# EasyEDA Pro project hub_2025-11-01.epro

# Schematic hub
Board Name: hub; Create Date: 2025-10-30; Page Name: Sheet_1; Project Name: Makro; Schematic Name: hub; Update Date: 2025-10-30; Add into BOM: yes; Convert to PCB: yes; Sheet: 1/1; spicePre: .
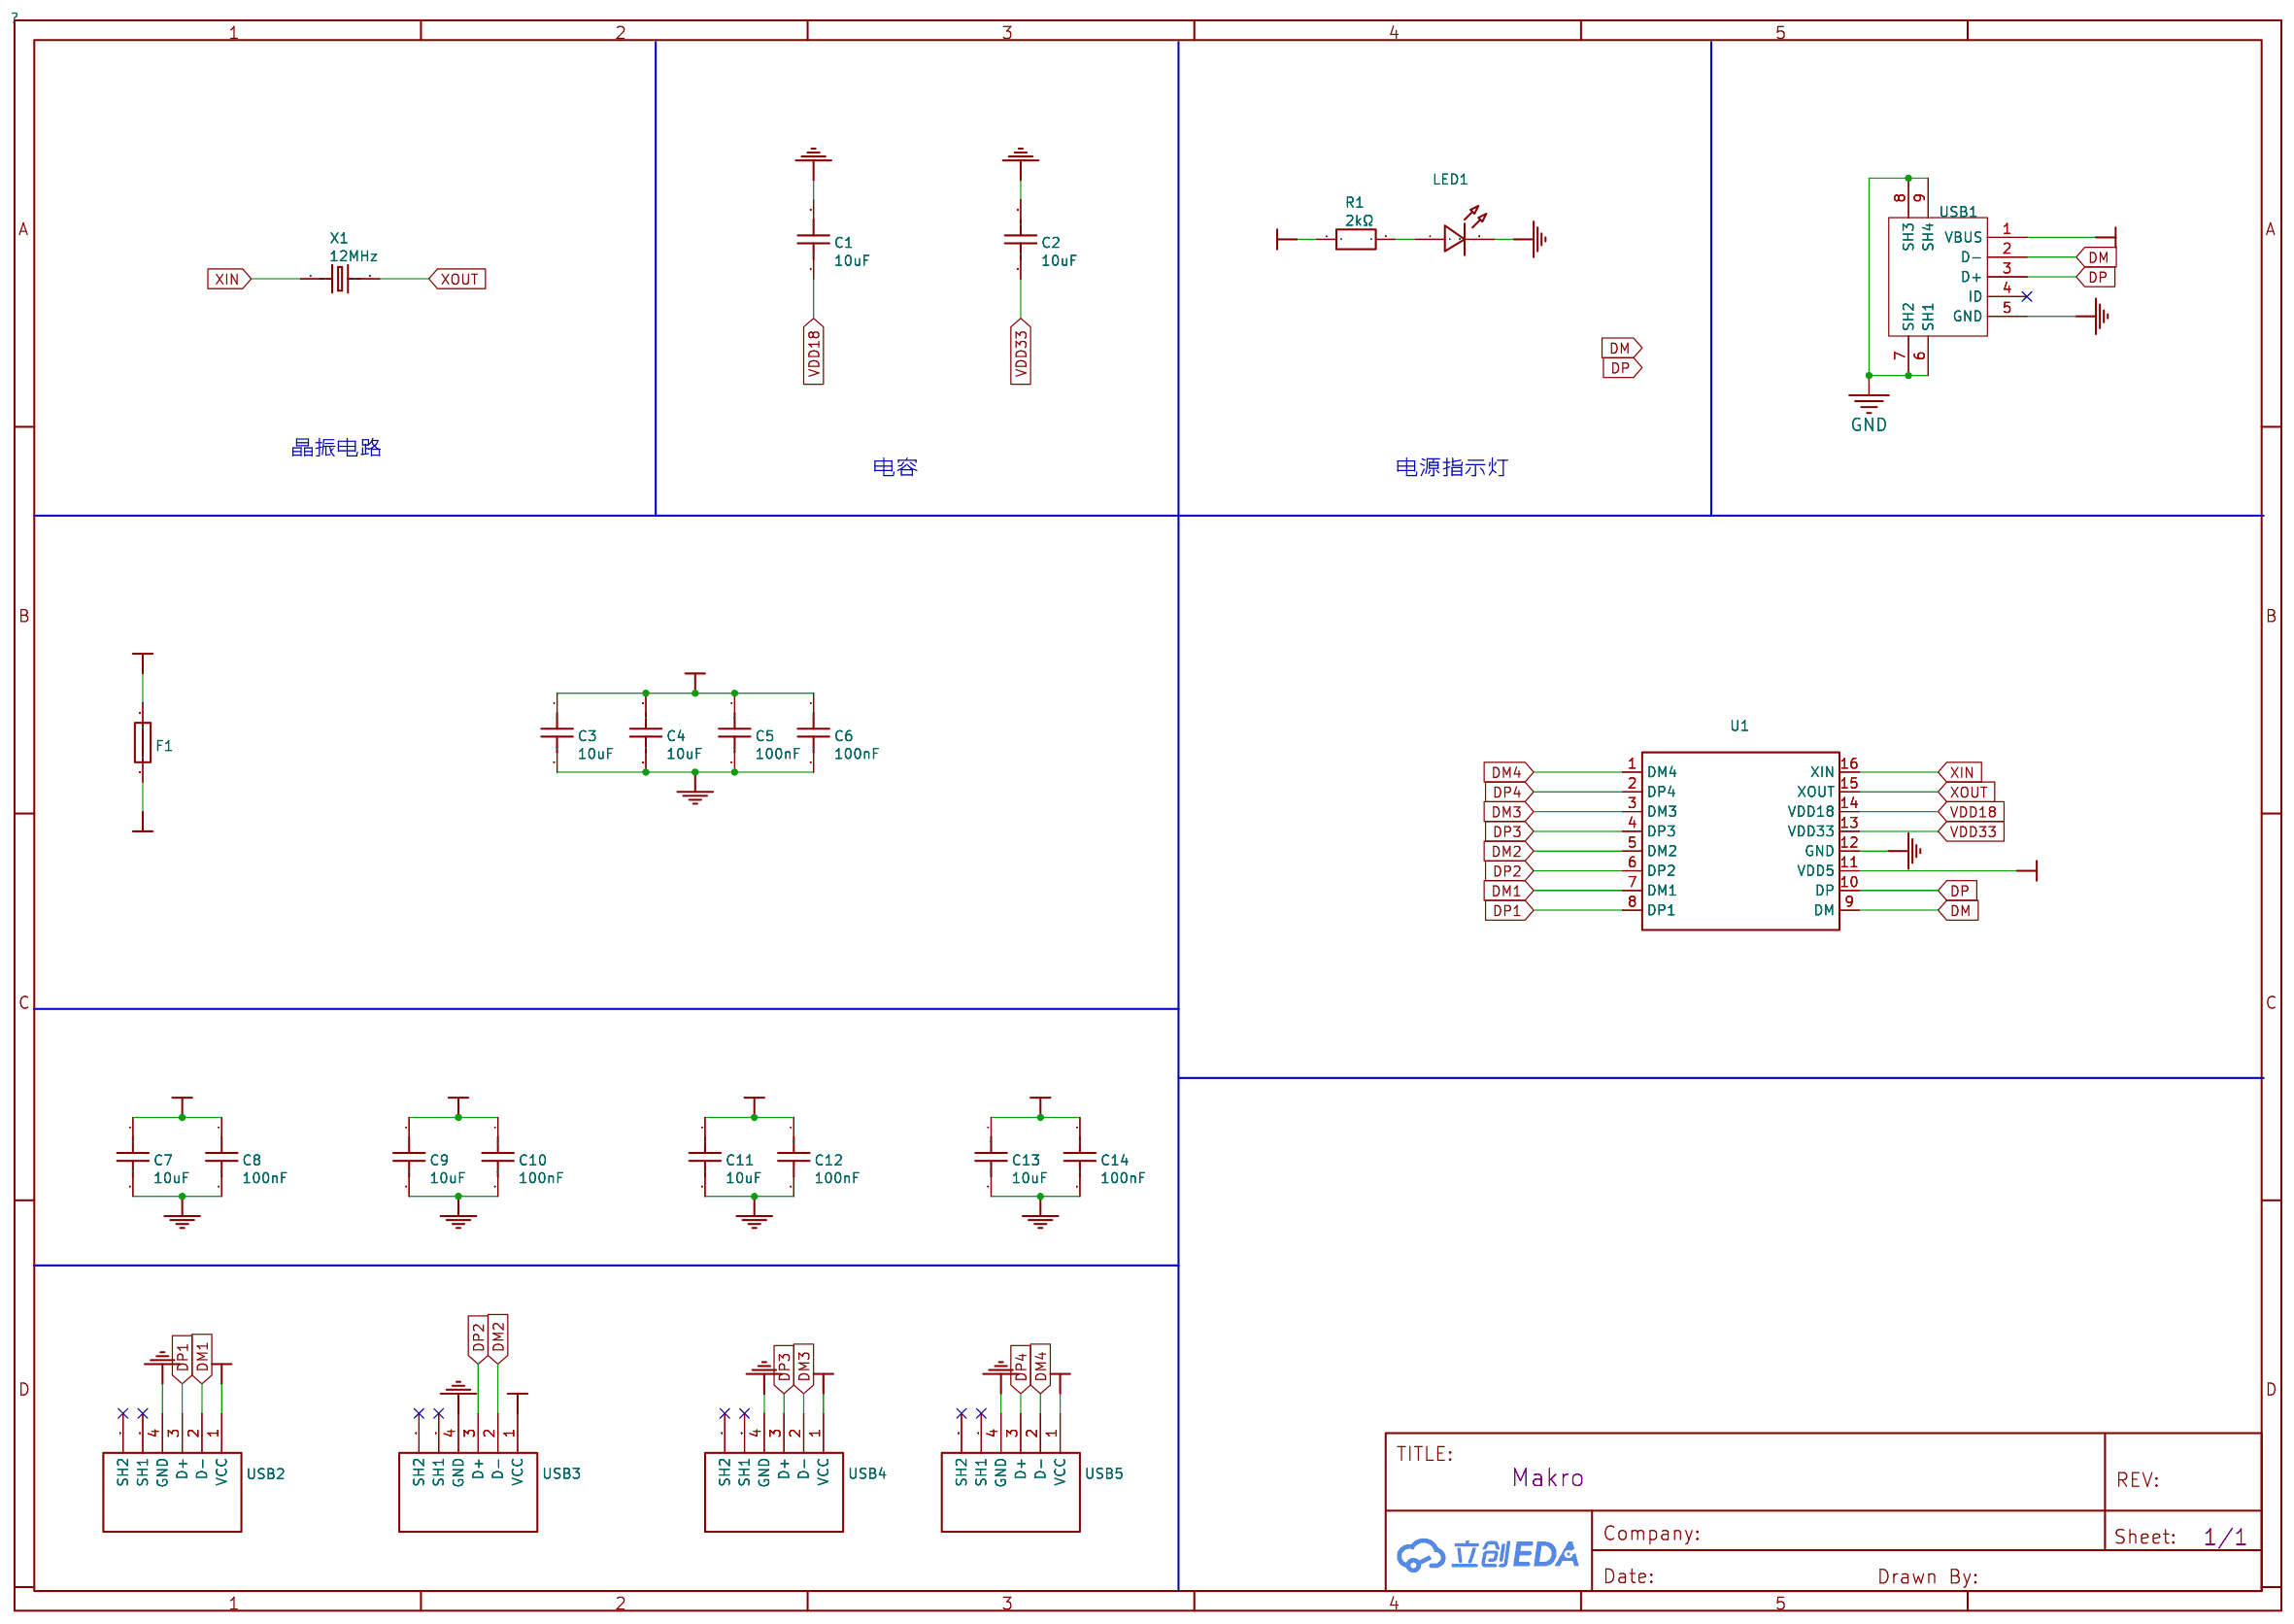
[diagram p0: schematic sheet]

## Parts
C1  10uF  [C0603]
C2  10uF  [C0603]
C3  10uF  [C0603]
C4  10uF  [C0603]
C5  100nF  [C0603]
C6  100nF  [C0603]
C7  10uF  [C0603]
C8  100nF  [C0603]
C9  10uF  [C0603]
C10  100nF  [C0603]
C11  10uF  [C0603]
C12  100nF  [C0603]
C13  10uF  [C0603]
C14  100nF  [C0603]
F1  FSMD100-1206R  [F1206]
LED1  19-217/R6C-AL1M2VY/3T  [LED0603-RD]
R1  2kΩ  [R0603]
U1  SL2.1A  [SOP-16_L10.0-W3.9-P1.27-LS6.0-BL]
USB1  MicroXNJ  [MICRO-USB-SMD_MICROXNJ]
USB2  U-USBAR04P-F002  [USB-A-TH_USB-302-T]
USB3  U-USBAR04P-F002  [USB-A-TH_USB-302-T]
USB4  U-USBAR04P-F002  [USB-A-TH_USB-302-T]
USB5  U-USBAR04P-F002  [USB-A-TH_USB-302-T]
X1  12MHz  [HC-49US_L11.5-W4.5-P4.88]

## Library data of the parts
C1-C4 C7 C9 C11 C13 = 0603X106M6R3NT: Capacitance:10uF Tolerance:±20% Tolerance:±20% Voltage Rating:6.3V Temperature Coefficient:X5R; LCSC Part Name: 10uF ±20% 6.3V; Supplier Part: C105490; Manufacturer: FH(风华); Supplier Footprint: 0603; JLCPCB Part Class: Extended Part; Datasheet: https://item.szlcsc.com/datasheet/0603X106M6R3NT/106705.html; Supplier: LCSC; Tolerance: ±20%; Voltage Rating: 6.3V; Temperature Coefficient: X5R
C5 C6 C8 C10 C12 C14 = C0603X104K101T: Capacitance:100nF Tolerance:±10% Tolerance:±10% Voltage Rating:100V Temperature Coefficient:X7R; LCSC Part Name: 100nF ±10% 100V; Supplier Part: C105907; Manufacturer: IHHEC(禾伸堂); Supplier Footprint: 0603; JLCPCB Part Class: Extended Part; Datasheet: https://item.szlcsc.com/datasheet/C0603X104K101T/107122.html; Supplier: LCSC; Tolerance: ±10%; Voltage Rating: 100V; Temperature Coefficient: X7R
F1 = FSMD100-1206R: Voltage - Max:6V Current - Max:100A Hold Current:1A Trip Current:1.8A Power Dissipation:600mW Resistance - Initial (Ri) (Min):55mΩ Resistance - Post Trip (R1) (Max):210mΩ Time to Trip(Max):300ms Operating Temperature:-40℃~+85℃ Operating Temperature:-40℃~+; LCSC Part Name: 1A  6V自恢复保险丝; Supplier Part: C220149; Manufacturer: FUZETEC(富致); Supplier Footprint: 1206; JLCPCB Part Class: Extended Part; Datasheet: https://item.szlcsc.com/datasheet/FSMD100-1206R/220722.html; Supplier: LCSC; Voltage - Max: 6V; Current - Max: 100A; Hold Current: 1A; Trip Current: 1.8A; Power Dissipation: 600mW; Resistance - Initial (Ri) (Min): 55mΩ; Resistance - Post Trip (R1) (Max): 210mΩ; Time to Trip(Max): 300ms; Operating Temperature: -40℃~+85℃; Length: 3.5mm; Width: 1.8mm; Height: 1mm
LED1 = 19-217/R6C-AL1M2VY/3T: Illumination Color:Red Voltage - Forward(Vf):1.95V Voltage - Forward(Vf):1.95V Power(Watts):60mW Forward Current:5mA Wavelength - Dominant:617.5nm Wavelength - Dominant:617.5nm Peak Wavelength:632nm Diode Configuration:- Lens Color:Water Clear Color Tempe; LCSC Part Name: 红灯 停产; Supplier Part: C72044; Manufacturer: EVERLIGHT(亿光); Supplier Footprint: 0603; JLCPCB Part Class: Extended Part; Supplier: LCSC; Illumination Color: Red; Voltage - Forward(Vf): 1.95V; Power(Watts): 60mW; Forward Current: 5mA; Wavelength - Dominant: 617.5nm; Peak Wavelength: 632nm; Lens Color: Water Clear; Viewing Angle: 120°; Operating Temperature: -40℃~+85℃
R1 = RTT03202JTP: Type:Thick Film Resistor Resistance:2kΩ Tolerance:±5% Tolerance:±5% Power(Watts):100mW Voltage-Supply(Max):75V Temperature Coefficient:±100ppm/℃ Temperature Coefficient:±100ppm/℃ Operating Temperature:-55℃~+155℃ Operating Temperature:-55℃~+155℃; LCSC Part Name: 厚膜电阻 2kΩ ±5% 100mW; Supplier Part: C103396; Manufacturer: RALEC(旺诠); Supplier Footprint: 0603; JLCPCB Part Class: Extended Part; Datasheet: https://item.szlcsc.com/datasheet/RTT03202JTP/104611.html; Supplier: LCSC; Type: Thick Film Resistor; Tolerance: ±5%; Power(Watts): 100mW; Voltage-Supply(Max): 75V; Temperature Coefficient: ±100ppm/℃; Operating Temperature: -55℃~+155℃
U1 = SL2.1A: type:Hub USB Protocol:USB 2.0 Voltage - Supply:4V~5.25V Voltage - Supply:4V~5.25V Operating Temperature:0℃~+70℃ Operating Temperature:0℃~+70℃ Current - Supply:120mA Supply Current (Iq):2.5mA Number of Channels:4; LCSC Part Name: USB2.0高速4端口HUB控制器; Supplier Part: C192893; Manufacturer: CoreChips(和芯润德); Supplier Footprint: SOP-16; JLCPCB Part Class: Extended Part; Datasheet: https://atta.szlcsc.com/upload/public/pdf/source/20180522/C192893_624110D24898D57AAC785E3DF98EA862.pdf; Supplier: LCSC; type: Hub; USB Protocol: USB 2.0; Voltage - Supply: 4V~5.25V; Operating Temperature: 0℃~+70℃; Current - Supply: 120mA; Supply Current (Iq): 2.5mA; Number of Channels: 4
USB1 = MicroXNJ: Connector Type:Micro-B Standard:USB 2.0 Gender:Female Mounting Style:Horizontal attachment Number of Contacts:5P Number of Ports:1 Current Rating - Power (Max):1.8A Operating Temperature Range:-20℃~+85℃ Operating Temperature Range:-20℃~+85℃ Rated Voltage; LCSC Part Name: Micro-B 母 卧贴; Supplier Part: C404969; Manufacturer: SHOU HAN(首韩); Supplier Footprint: SMD; JLCPCB Part Class: Extended Part; Datasheet: https://atta.szlcsc.com/upload/public/pdf/source/20220415/2494EDFF499AF6F852F7C820374B6AF3.pdf; Supplier: LCSC; Connector Type: Micro-B; Standard: USB 2.0; Gender: Female; Mounting Style: Horizontal attachment; Number of Contacts: 5P; Number of Ports: 1; Current Rating - Power (Max): 1.8A; Operating Temperature Range: -20℃~+85℃; Rated Voltage (Max): 30V; Connect-Disconnect Life: 5000 Cuts; Core Colour: Black
USB2-USB5 = U-USBAR04P-F002: Connector Type:Type-A Protocol Standard:USB 2.0 Gender:Female Mounting Type:Right Angle Number of Contacts:4P Number of Ports:1 Current Rating-Power:1.5A Operating Temperature:0℃~+50℃ Operating Temperature:0℃~+50℃; LCSC Part Name: Type-A 母 弯插; Supplier Part: C386736; Manufacturer: Ckmtw(灿科盟); Supplier Footprint: 插件; JLCPCB Part Class: Extended Part; Datasheet: https://item.szlcsc.com/datasheet/U-USBAR04P-F002/360843.html; Supplier: LCSC; Connector Type: Type-A; Protocol Standard: USB 2.0; Gender: Female; Mounting Type: Right Angle; Number of Contacts: 4P; Number of Ports: 1; Current Rating-Power: 1.5A; Operating Temperature: 0℃~+50℃
X1 = XIHCELNANF-12MHZ: Type:Through-Hole Crystal Oscillator Frequency:12MHz Normal temperature Frequency Tolerance:±30ppm Normal temperature Frequency Tolerance:±30ppm Load Capacitance:20pF Frequency Stability:±30ppm Frequency Stability:±30ppm Operating Temperature:-40℃~+85℃ Op; LCSC Part Name: 12MHz ±30ppm 20pF; Supplier Part: C295072; Manufacturer: TAITIEN(泰艺电子); Supplier Footprint: HC-49S; JLCPCB Part Class: Extended Part; Datasheet: https://atta.szlcsc.com/upload/public/pdf/source/20190107/C358649_B3943D1FEB8737E4FCE005A191A94016.pdf; Supplier: LCSC; Type: Through-Hole Crystal Oscillator; Normal temperature Frequency Tolerance: ±30ppm; Load Capacitance: 20pF; Frequency Stability: ±30ppm; Operating Temperature: -40℃~+85℃

## Nets
+5V: C3.1 C4.1 C5.1 C6.1 C7.1 C8.1 C9.1 C10.1 C11.1 C12.1 C13.1 C14.1 F1.1 R1.1 U1.11(VDD5) USB2.1(VCC) USB3.1(VCC) USB4.1(VCC) USB5.1(VCC)
GND: C1.2 C2.2 C3.2 C4.2 C5.2 C6.2 C7.2 C8.2 C9.2 C10.2 C11.2 C12.2 C13.2 C14.2 LED1.2 U1.12(GND) USB1.5(GND) USB1.6(SH1) USB1.7(SH2) USB1.8(SH3) USB1.9(SH4) USB2.4(GND) USB3.4(GND) USB4.4(GND) USB5.4(GND)
VBUS: F1.2 USB1.1(VBUS)
VDD18: C1.1 U1.14(VDD18)
VDD33: C2.1 U1.13(VDD33)
DM: U1.9(DM) USB1.2(D-)
DM1: U1.7(DM1) USB2.2(D-)
DM2: U1.5(DM2) USB3.2(D-)
DM3: U1.3(DM3) USB4.2(D-)
DM4: U1.1(DM4) USB5.2(D-)
DP: U1.10(DP) USB1.3(D+)
DP1: U1.8(DP1) USB2.3(D+)
DP2: U1.6(DP2) USB3.3(D+)
DP3: U1.4(DP3) USB4.3(D+)
DP4: U1.2(DP4) USB5.3(D+)
XIN: U1.16(XIN) X1.1
XOUT: U1.15(XOUT) X1.2
$LED1_1: LED1.1 R1.2

Not connected (* = marked no-connect by the designer): USB1 4(ID)*; USB2 5(SH1)* 6(SH2)*; USB3 5(SH1)* 6(SH2)*; USB4 5(SH1)* 6(SH2)*; USB5 5(SH1)* 6(SH2)*

## Notes on the sheet
- 晶振电路
- 电容
- 电源指示灯
